# EAGLE design RF212_Radio_Base (EAGLE 4.16)
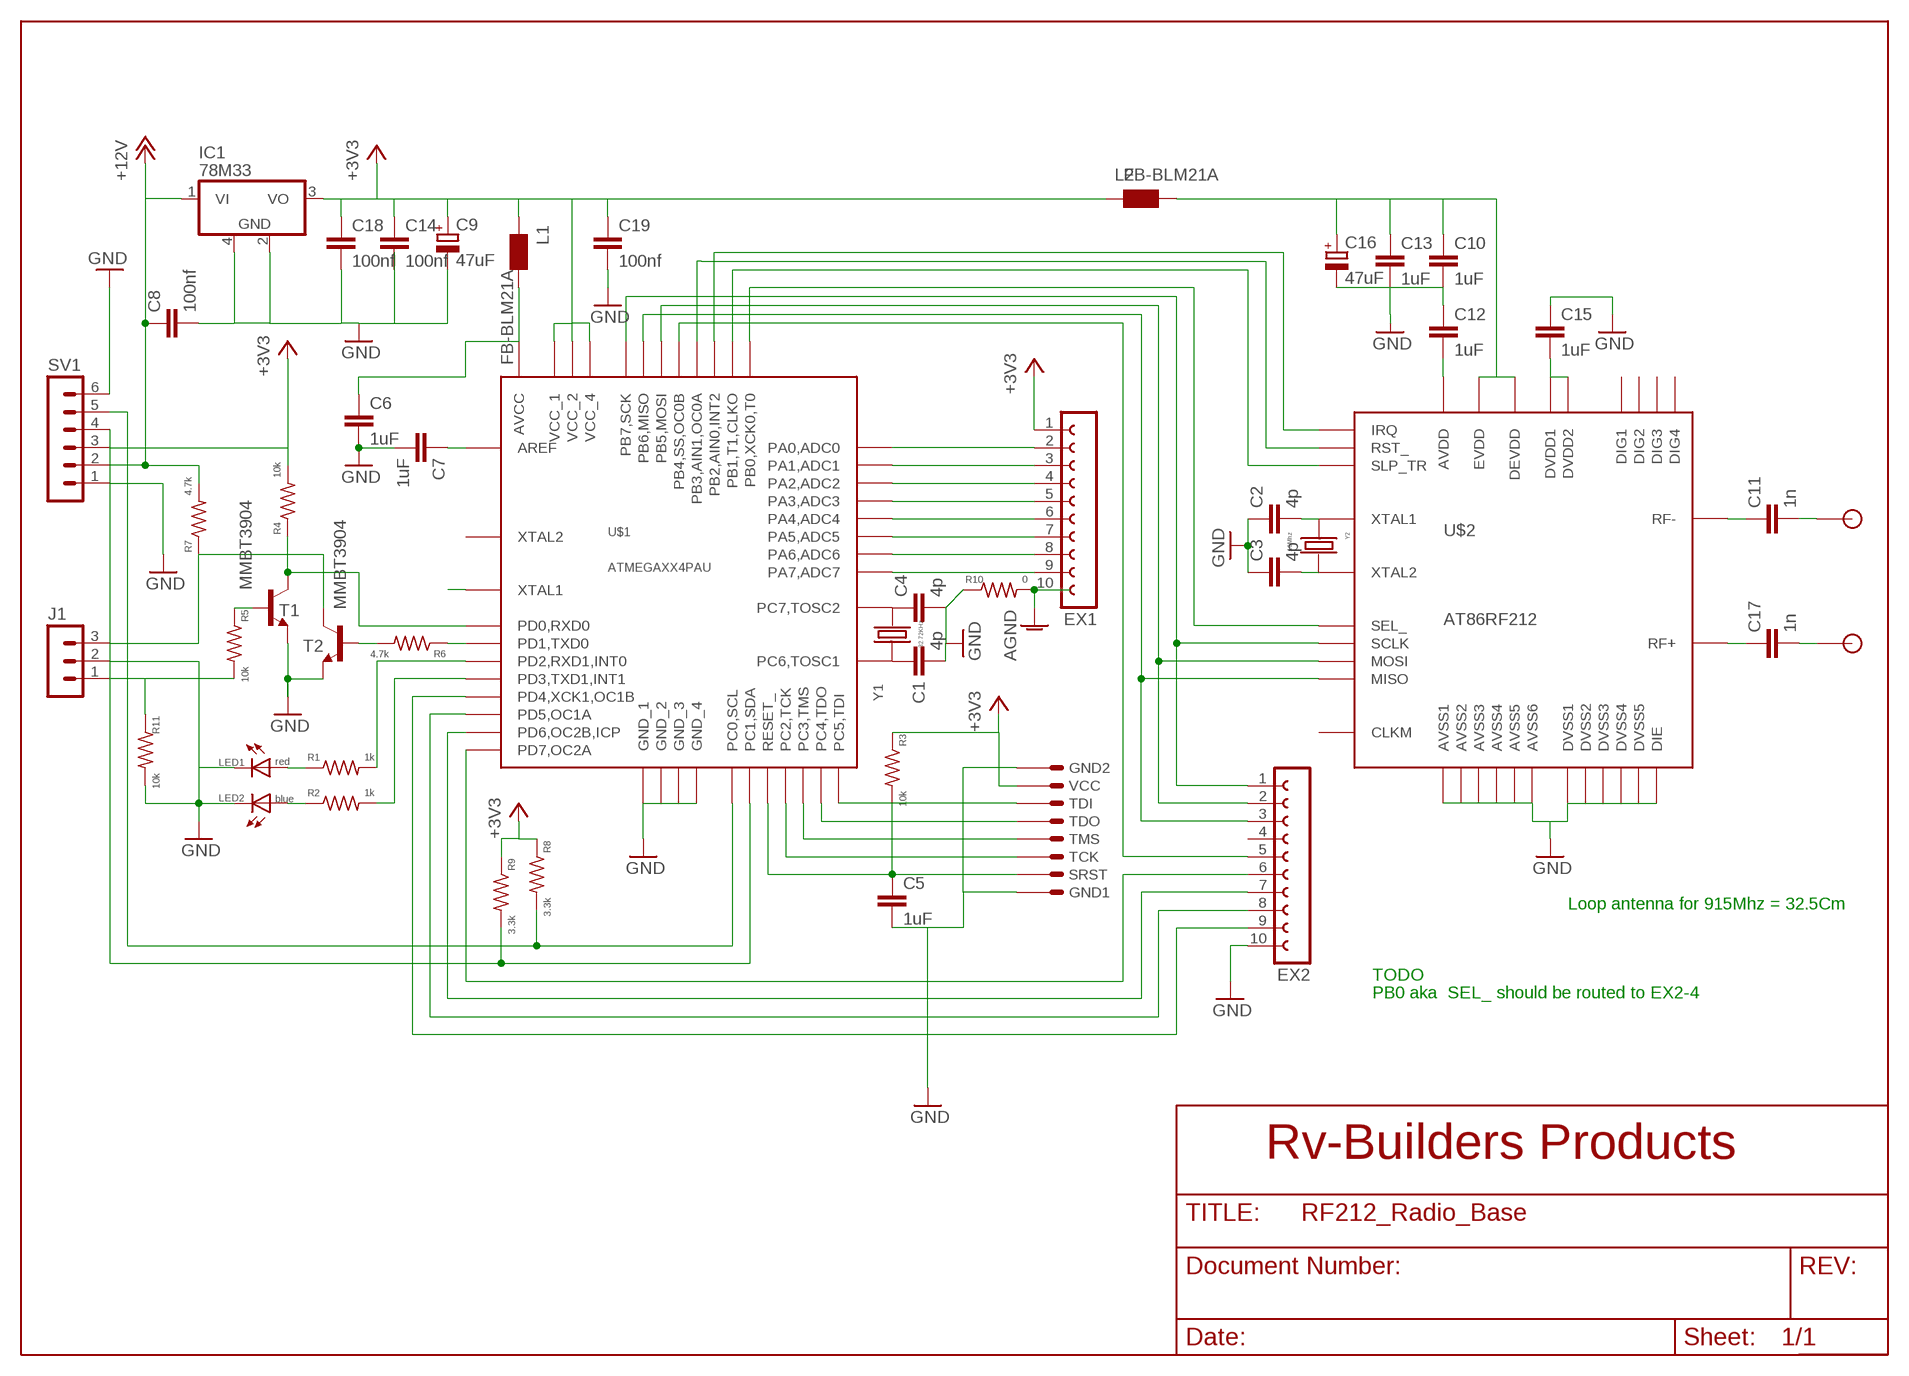
[diagram p0: schematic, sheet 1]

## Parts
C1  4p  C-EUC0805  [C0805]
C2  4p  C-EUC0805  [C0805]
C3  4p  C-EUC0805  [C0805]
C4  4p  C-EUC0805  [C0805]
C5  1uF  C-EUC0805  [C0805]
C6  1uF  C-EUC0805  [C0805]
C7  1uF  C-EUC0805  [C0805]
C8  100nf  C-EUC0805  [C0805]
C9  47uF  CPOL-EUSMCB  [SMC_B]
C10  1uF  C-EUC0805  [C0805]
C11  1n  C-EUC0805  [C0805]
C12  1uF  C-EUC0805  [C0805]
C13  1uF  C-EUC0805  [C0805]
C14  100nf  C-EUC0805  [C0805]
C15  1uF  C-EUC0805  [C0805]
C16  47uF  CPOL-EUSMCB  [SMC_B]
C17  1n  C-EUC0805  [C0805]
C18  100nf  C-EUC0805  [C0805]
C19  100nf  C-EUC0805K  [C0805K]
EX1  FE10-1  [FE10]
EX2  FE10-1  [FE10]
IC1  78M33  LM340MP-05  [SOT223]
J1  MA03-1  [MA03-1]
L1  FB-BLM21A  WE-CBF_0805  [0805]
L2  FB-BLM21A  WE-CBF_0805  [0805]
LED1  red  LEDCHIPLED_0603  [CHIPLED_0603]
LED2  blue  LEDCHIPLED_0603  [CHIPLED_0603]
R1  1k  R-US_R0603  [R0603]
R2  1k  R-US_R0603  [R0603]
R3  10k  R-US_R0805  [R0805]
R4  10k  R-US_R0805  [R0805]
R5  10k  R-US_R0805  [R0805]
R6  4.7k  R-US_R0805  [R0805]
R7  4.7k  R-US_R0805  [R0805]
R8  3.3k  R-US_R0805  [R0805]
R9  3.3k  R-US_R0805  [R0805]
R10  0  R-US_R0603  [R0603]
R11  10k  R-US_R0805  [R0805]
SV1  MA06-1  [MA06-1]
T1  MMBT3904  BC846-NPN-SOT23-BEC  [SOT23-BEC]
T2  MMBT3904  BC846A-NPN-SOT23-BEC  [SOT23-BEC]
U$1  ATMEGAXX4PAU  [TQFP44]
U$2  AT86RF212  [S-PQFP-N32(RHB)]
U$3  JTAG_8P_2X4  [HEADER2X4_50]
U$4  WIRE_POINTMEDIUM  [WIRE_MEDIUM]
U$5  WIRE_POINTMEDIUM  [WIRE_MEDIUM]
Y1  32.72KHz  CRYSTALWATCH  [CRYSTAL32_SMT]
Y2  16Mhz  CRYSTALSMD  [CRYSTAL3.2X2.5]

## Nets
+3V3: C9.+ C14.1 C18.1 C19.1 EX1.1 IC1.3(VO) L1.1 L2.1 R3.1 R4.2 R8.1 R9.1 SV1.3 U$1.5(VCC_1) U$1.17(VCC_2) U$1.38(VCC_4) U$3.VCC
+12V: C8.1 IC1.1(VI) R7.2 SV1.2
ADC0: EX1.2 U$1.37(PA0,ADC0)
ADC1: EX1.3 U$1.36(PA1,ADC1)
ADC2: EX1.4 U$1.35(PA2,ADC2)
ADC3: EX1.5 U$1.34(PA3,ADC3)
ADC4: EX1.6 U$1.33(PA4,ADC4)
ADC5: EX1.7 U$1.32(PA5,ADC5)
ADC6: EX1.8 U$1.31(PA6,ADC6)
ADC7: EX1.9 U$1.30(PA7,ADC7)
AGND: EX1.10 R10.2
AREF: C7.1 U$1.29(AREF)
AVCC: C6.1 L1.2 U$1.27(AVCC)
GND: C1.2 C2.1 C3.1 C4.2 C5.2 C6.2 C7.2 C8.2 C9.- C10.2 C12.1 C13.2 C14.2 C15.1 C16.- C18.2 C19.2 EX2.10 IC1.2(GND1) IC1.4(GND) J1.2 LED1.C LED2.C R10.1 R11.2 SV1.1 SV1.6 T1.E T2.E U$1.6(GND_1) U$1.18(GND_2) U$1.28(GND_3) U$1.39(GND_4) U$2.3(AVSS1) U$2.6(AVSS2) U$2.7(DVSS1) U$2.12(DVSS2) U$2.16(DVSS3) U$2.18(DVSS4) U$2.21(DVSS5) U$2.27(AVSS3) U$2.30(AVSS4) U$2.31(AVSS5) U$2.32(AVSS6) U$2.P$1(DIE) U$3.GND1 U$3.GND2
IRQ: U$1.42(PB2,AIN0,INT2) U$2.24(IRQ)
MISO: EX2.3 U$1.2(PB6,MISO) U$2.20(MISO)
MOSI: EX2.2 U$1.1(PB5,MOSI) U$2.22(MOSI)
N$1: C4.1 U$1.26(PC7,TOSC2) Y1.2
N$2: C1.1 U$1.25(PC6,TOSC1) Y1.1
N$3: C2.2 U$2.26(XTAL1) Y2.IN
N$4: C3.2 U$2.25(XTAL2) Y2.OUT
N$11: C12.2 U$2.29(AVDD)
N$12: EX2.6 U$1.16(PD7,OC2A)
N$14: LED1.A R1.1
N$15: LED2.A R2.1
N$16: R2.2 U$1.12(PD3,TXD1,INT1)
N$17: C15.2 U$2.13(DVDD1) U$2.14(DVDD2)
N$18: C10.1 C13.1 C16.+ L2.2 U$2.15(DEVDD) U$2.28(EVDD)
N$27: C11.1 U$2.5(RF-)
N$28: C17.1 U$2.4(RF+)
N$29: C11.2 U$4.P$1
N$30: C17.2 U$5.P$1
N$39: U$1.8(XTAL1)
N$40: R4.1 T1.C U$1.9(PD0,RXD0)
N$42: R9.2 SV1.4 U$1.20(PC1,SDA)
N$44: R6.1 U$1.10(PD1,TXD0)
N$47: R8.2 SV1.5 U$1.19(PC0,SCL)
N$48: EX2.7 U$1.15(PD6,OC2B,ICP)
N$49: EX2.8 U$1.14(PD5,OC1A)
N$50: EX2.9 U$1.13(PD4,XCK1,OC1B)
N$51: R1.2 U$1.11(PD2,RXD1,INT0)
RF_CHIP_DEVSEL: U$1.40(PB0,XCK0,T0) U$2.23(SEL_)
RS232_RX: J1.1 R5.2 R11.1
RS232_TX: J1.3 R7.1 T2.C
RST_: U$1.43(PB3,AIN1,OC0A) U$2.8(RST_)
RX_BASE: R5.1 T1.B
SCK: EX2.1 U$1.3(PB7,SCK) U$2.19(SCLK)
SLP: U$1.41(PB1,T1,CLKO) U$2.11(SLP_TR)
SPI_SS: EX2.5 U$1.44(PB4,SS,OC0B)
SRST: C5.1 R3.2 U$1.4(RESET_) U$3.SRST
TCK: U$1.21(PC2,TCK) U$3.TCK
TDI: U$1.24(PC5,TDI) U$3.TDI
TDO: U$1.23(PC4,TDO) U$3.TDO
TMS: U$1.22(PC3,TMS) U$3.TMS
TX_BASE: R6.2 T2.B
Unconnected: EX2.4 U$1.7(XTAL2) U$2.1(DIG3) U$2.2(DIG4) U$2.9(DIG1) U$2.10(DIG2) U$2.17(CLKM)

## Notes on the sheet
- Loop antenna for 915Mhz = 32.5Cm
- TODO
- PB0 aka  SEL_ should be routed to EX2-4

## Library data of the parts
C1-C8 C10-C15 C17-C19 = rcl:C-EU: CAPACITOR, European symbol
C9 C16 = rcl:CPOL-EU: POLARIZED CAPACITOR, European symbol
EX1 EX2 = con-lsta:FE10-1: FEMALE HEADER
IC1 = ATMEL:LM340?-*: Positive VOLTAGE REGULATOR Source: http://cache.national.com/ds/LM/LM340.pdf
J1 = con-lstb:MA03-1: PIN HEADER
L1 L2 = wuerth-elektronik:WE-CBF: SMD EMI Suppression Ferrite Beads - excellent anti-EMI properties - low DCR - impedances till 3000 ohms - rated current up to 6 A
LED1 LED2 = led:LED: LED OSRAM: - CHIPLED LG R971, LG N971, LY N971, LG Q971, LY Q971, LO R971, LY R971 LH N974, LH R974 LS Q976, LO Q976, LY Q976 LO Q996 - Hyper CHIPLED LW Q18S LB Q993, LB Q99A, LB R99A - SideLED LS A670, LO A670, LY A670, LG A670, LP A670 LB A673, LV A673, LT A673, LW A673 LH A674 LY A675 LS A676, LA A676, LO A676, LY A676, LW A676 LS A679, LY A679, LG A679 - Hyper Micro SIDELED® LS Y876, LA Y876, LO Y876, LY Y876 LT Y87S - SmartLED LW L88C, LW L88S LB L89C, LB L89S, LG L890 LS L89K, LO L89K, LY L89K LS L896, LA L896, LO L896, LY L896 - TOPLED LS T670, LO T670, LY T670, LG T670, LP T670 LSG T670, LSP T670, LSY T670, LOP T670, LYG T670 LG T671, LOG T671, LSG T671 LB T673, LV T673, LT T673, LW T673 LH T674 LS T676, LA T676, LO T676, LY T676, LB T676, LH T676, LSB T676, LW T676 LB T67C, LV T67C, LT T67C, LS T67K, LO T67K, LY T67K, LW E67C LS E67B, LA E67B, LO E67B, LY E67B, LB E67C, LV E67C, LT E67C LW T67C LS T679, LY T679, LG T679 LS T770, LO T770, LY T770, LG T770, LP T770 LB T773, LV T773, LT T773, LW T773 LH T774 LS E675, LA E675, LY E675, LS T675 LS T776, LA T776, LO T776, LY T776, LB T776 LHGB T686 LT T68C, LB T68C - Hyper Mini TOPLED® LB M676 - Mini TOPLED Santana® LG M470 LS M47K, LO M47K, LY M47K Source: http://www.osram.convergy.de - LUMILED® LXK2-PW12-R00, LXK2-PW12-S00, LXK2-PW14-U00, LXK2-PW14-V00 LXK2-PM12-R00, LXK2-PM12-S00, LXK2-PM14-U00 LXK2-PE12-Q00, LXK2-PE12-R00, LXK2-PE12-S00, LXK2-PE14-T00, LXK2-PE14-U00 LXK2-PB12-K00, LXK2-PB12-L00, LXK2-PB12-M00, LXK2-PB14-N00, LXK2-PB14-P00, LXK2-PB14-Q00 LXK2-PR12-L00, LXK2-PR12-M00, LXK2-PR14-Q00, LXK2-PR14-R00 LXK2-PD12-Q00, LXK2-PD12-R00, LXK2-PD12-S00 LXK2-PH12-R00, LXK2-PH12-S00 LXK2-PL12-P00, LXK2-PL12-Q00, LXK2-PL12-R00 Source: www.luxeon.com
R1-R11 = rcl:R-US_: RESISTOR, American symbol
SV1 = con-lstb:MA06-1: PIN HEADER
T1 T2 = transistor:*-NPN-: NPN Transistror
U$1 = ATMEL:ATMEGAXX4P
U$2 = ATMEL:AT86RF212
U$3 = ATMEL:JTAG_8P_
U$4 U$5 = ATMEL:WIRE_POINT
Y1 Y2 = ATMEL:CRYSTAL

## Board
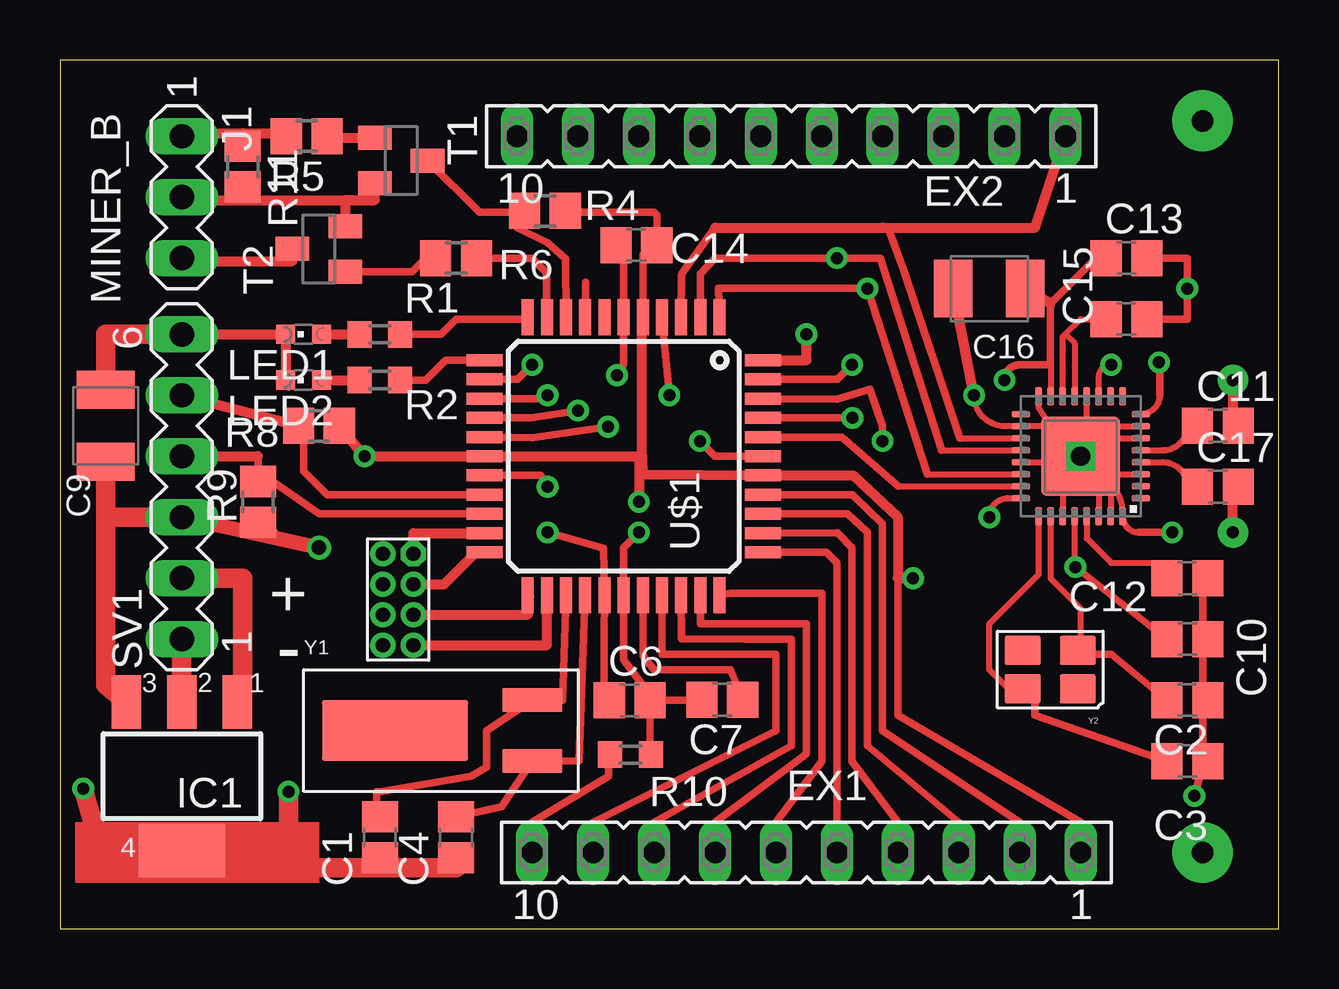
[diagram p1: board, top side]
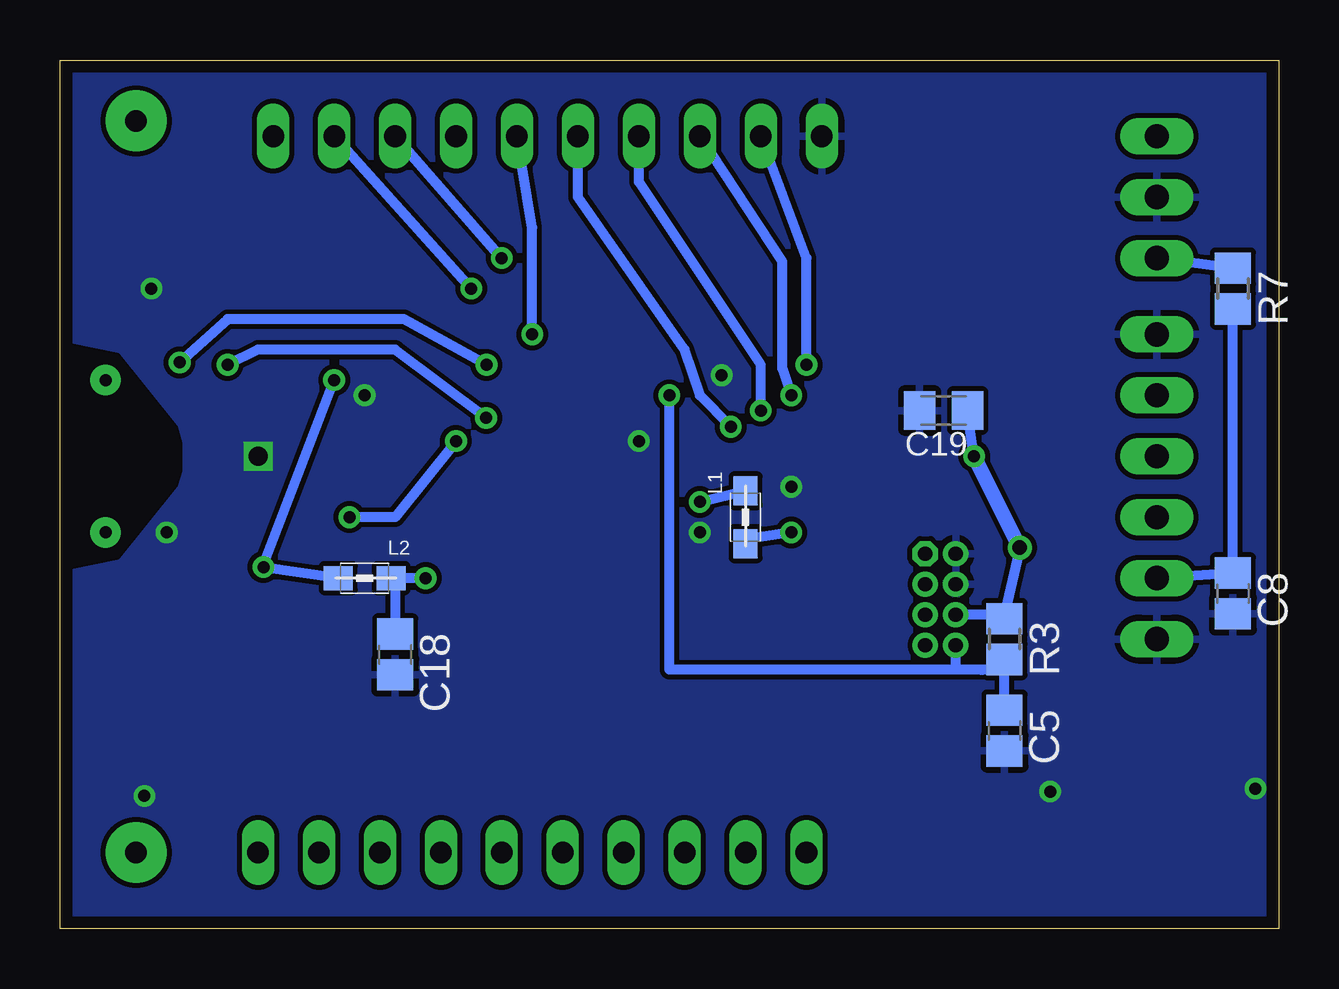
[diagram p2: board, bottom side, seen from below]

Size 50.8 x 36.2 mm. Coordinates in mm from the lower left corner, seen from the top.
Outline: 0,0 50.8,0 50.8,36.2 0,36.2 0,0
Copper layers (1*16): Top 0.0356mm / dielectric 1.5011mm / Bottom 0.0356mm
Design rules "Silvercircuits": minimum track width 7mil, minimum drill 16mil, track to track 8mil, track to pad 8mil, pad to pad 8mil, via to via 8mil, smd to smd 0mil, copper to edge 20mil, drill to drill 8mil, minimum pad ring 9mil, minimum via ring 8mil, stop-mask expansion 4mil, vias tented up to drill 0mil, thermal gap 10mil

### Footprints (pad centres in the part's own frame; a part is rotated, then mirrored left to right if it is on the bottom)
C0805 = smd 1.3 x 1.5: 1 -0.85,0; 2 0.85,0
SMC_B = smd 1.6 x 2.4: + -1.5,0; - 1.5,0
C0805K = smd 1.3 x 1.6: 1 -1,0; 2 1,0
FE10 = drill 0.9 long: 1 -11.43,0; 2 -8.89,0; 3 -6.35,0; 4 -3.81,0; 5 -1.27,0; 6 1.27,0; 7 3.81,0; 8 6.35,0; 9 8.89,0; 10 11.43,0
SOT223 = smd 1.219 x 2.235: 1 -2.311,-3.099; 2 0,-3.099; 3 2.311,-3.099 | smd 3.6 x 2.2: 4 0,3.099
MA03-1 = drill 1.016 long: 1 -2.54,0; 2 0,0; 3 2.54,0
0805 = smd 1.2 x 1: 1 -1.1,0; 2 1.1,0
CHIPLED_0603 = smd 0.8 x 0.8: A 0,-0.75; C 0,0.75
R0603 = smd 1 x 1.1: 1 -0.85,0; 2 0.85,0
R0805 = smd 1.3 x 1.5: 1 -0.85,0; 2 0.85,0
MA06-1 = drill 1.016 long: 1 -6.35,0; 2 -3.81,0; 3 -1.27,0; 4 1.27,0; 5 3.81,0; 6 6.35,0
SOT23-BEC = smd 1 x 1.4: B -0.95,-1.1; C 0,1.1; E 0.95,-1.1
TQFP44 = smd 1.5 x 0.5: 1 -5.8,4; 2 -5.8,3.2; 3 -5.8,2.4; 4 -5.8,1.6; 5 -5.8,0.8; 6 -5.8,0; 7 -5.8,-0.8; 8 -5.8,-1.6; 9 -5.8,-2.4; 10 -5.8,-3.2; 11 -5.8,-4; 23 5.8,-4; 24 5.8,-3.2; 25 5.8,-2.4; 26 5.8,-1.6; 27 5.8,-0.8; 28 5.8,0; 29 5.8,0.8; 30 5.8,1.6; 31 5.8,2.4; 32 5.8,3.2; 33 5.8,4 | smd 0.5 x 1.5: 12 -4,-5.8; 13 -3.2,-5.8; 14 -2.4,-5.8; 15 -1.6,-5.8; 16 -0.8,-5.8; 17 0,-5.8; 18 0.8,-5.8; 19 1.6,-5.8; 20 2.4,-5.8; 21 3.2,-5.8; 22 4,-5.8; 34 4,5.8; 35 3.2,5.8; 36 2.4,5.8; 37 1.6,5.8; 38 0.8,5.8; 39 0,5.8; 40 -0.8,5.8; 41 -1.6,5.8; 42 -2.4,5.8; 43 -3.2,5.8; 44 -4,5.8
S-PQFP-N32(RHB) = smd 0.762 x 0.279: 1 -2.5,1.75; 2 -2.5,1.25; 3 -2.5,0.75; 4 -2.5,0.25; 5 -2.5,-0.25; 6 -2.5,-0.75; 7 -2.5,-1.25; 8 -2.5,-1.75; 17 2.5,-1.75; 18 2.5,-1.25; 19 2.5,-0.75; 20 2.5,-0.25; 21 2.5,0.25; 22 2.5,0.75; 23 2.5,1.25; 24 2.5,1.75 | smd 0.279 x 0.762: 9 -1.75,-2.5; 10 -1.25,-2.5; 11 -0.75,-2.5; 12 -0.25,-2.5; 13 0.25,-2.5; 14 0.75,-2.5; 15 1.25,-2.5; 16 1.75,-2.5; 25 1.75,2.5; 26 1.25,2.5; 27 0.75,2.5; 28 0.25,2.5; 29 -0.25,2.5; 30 -0.75,2.5; 31 -1.25,2.5; 32 -1.75,2.5 | smd 3.3 x 3.3: P$1 0,0
HEADER2X4_50 = drill 0.6 round: GND1 0,0; SRST 3.81,0; TDO 2.54,1.27; TMS 1.27,1.27; VCC 2.54,0 | drill 0.6 pad 1.016 round: GND2 1.27,0; TDI 3.81,1.27 | drill 0.6 octagon: TCK 0,1.27
WIRE_MEDIUM = drill 0.5 pad 1.27 round: P$1 0,0
CRYSTAL32_SMT = smd 2.5 x 1: 1 1.905,1.27; 2 1.905,-1.27 | smd 6.096 x 2.54: GND -3.81,0
CRYSTAL3.2X2.5 = smd 1.5 x 1.2: GND1 -1.147,0.8; GND2 1.15,-0.802; IN -1.147,-0.804; OUT 1.15,0.79

### Placement (x,y rotation side)
C1  13.34,3.81 270 top
C2  46.99,9.53 180 top
C3  46.99,6.98 180 top
C4  16.51,3.81 270 top
C5  11.43,8.26 270 bottom
C6  23.74,9.51 0 top
C7  27.61,9.54 180 top
C8  1.91,13.97 270 bottom
C9  1.91,20.96 90 top
C10  46.99,12.06 0 top
C11  48.26,20.96 0 top
C12  46.99,14.61 180 top
C13  44.45,27.94 0 top
C14  24.03,28.49 180 top
C15  44.45,25.4 180 top
C16  38.73,26.67 180 top
C17  48.26,18.42 0 top
C18  36.83,11.43 270 bottom
C19  13.97,21.59 180 bottom
EX1  31.11,3.17 180 top
EX2  30.48,33.02 180 top
IC1  5.08,6.35 180 top
J1  5.08,30.48 270 top
L1  22.23,17.15 270 bottom
L2  38.1,14.61 180 bottom
LED1  10.16,24.77 90 top
LED2  10.16,22.86 90 top
R1  13.34,24.77 0 top
R2  13.34,22.86 0 top
R3  11.43,12.06 270 bottom
R4  20.22,29.9 0 top
R5  10.29,33.02 180 top
R6  16.51,27.94 180 top
R7  1.91,26.67 270 bottom
R8  10.79,20.96 180 top
R9  8.26,17.78 90 top
R10  23.78,7.25 180 top
R11  7.62,31.75 270 top
SV1  5.08,18.42 90 top
T1  14.22,32 270 top
T2  10.79,28.32 90 top
U$1  23.5,19.69 270 top
U$2  42.55,19.69 180 top
U$3  13.46,15.62 270 top
U$4  48.9,22.86 0 top
U$5  48.9,16.51 0 top
Y1  17.78,8.26 0 top
Y2  41.27,10.79 180 top

### Tracks (layer width: path | path; a pad name or v marks a point on that pad's centre or on a via)
+3V3  (via drill 0.5, 0.6)
  Top 0.305: 34.92,14.61 34.92,8.89 42.55,4.45 EX1.1 | 24.26,25.47 U$1.5 24.3,28.11 24.77,28.58 24.85,28.49 C14.1 24.88,29.73 24.77,29.85 21.59,29.85 21.65,29.9 R4.2 | 24.13,19.69 24.27,19.69
  Top 0.406: 24.26,25.47 24.27,19.69 24.27,18.93 U$1.38 33.05,18.89 34.92,17.15 34.92,14.61 v35.56,14.61 | v24.13,17.78 24.13,19.69 U$1.17 v12.7,19.69 R8.1 | 8.85,16.31 8.89,16.51 R9.1
  Top 0.61: SV1.3 8.85,16.31 v10.79,15.88
  Top 0.813: IC1.3 1.91,10.16 1.91,17.15 | 1.91,17.15 SV1.3 | 1.91,17.15 C9.+
  Bottom 0.406: v24.13,17.78 L1.1 | v12.7,19.69 C19.1 | v35.56,14.61 L2.1 36.83,14.61 C18.1 | 11.43,13.08 R3.1 | 11.43,13.08 U$3.VCC | v10.79,15.88 11.43,13.08
  Bottom 0.61: v10.79,15.88 v12.7,19.69
+12V
  Top 0.61: 7.62,8.89 IC1.1
  Top 0.813: SV1.2 7.62,14.61 7.62,8.89
  Bottom 0.406: SV1.2 C8.1 R7.2
ADC0
  Top 0.305: 33.14,17.98 34.29,16.88 34.29,8.26 40.01,4.45 EX1.2 | 33.14,17.98 33.04,18.08 | 33.14,17.98 | U$1.37 33.04,18.09 33.14,17.98
ADC1
  Top 0.305: U$1.36 32.82,17.29 33.66,16.51 33.66,7.62 37.47,4.45 EX1.3
ADC2
  Top 0.305: U$1.35 32.41,16.49 33.02,15.88 33.02,6.98 34.92,4.45 EX1.4
ADC3
  Top 0.305: EX1.5 32.38,15.24 31.94,15.69 U$1.34
ADC4
  Top 0.305: EX1.6 29.84,4.45 31.75,6.98 31.75,13.97 27.94,13.97 27.53,13.9 U$1.33
ADC5
  Top 0.305: EX1.7 27.3,4.45 31.09,7.26 | 31.09,7.26 | 31.09,7.26 31.09,7.31 31.12,7.33 31.11,7.34 31.11,12.7 26.7,12.7 U$1.32
ADC6
  Top 0.305: EX1.8 24.77,4.45 30.48,7.62 30.48,12.06 28.57,12.06 25.9,12.07 U$1.31
ADC7
  Top 0.305: 28.57,11.43 29.84,11.43 29.84,8.26 22.23,4.45 EX1.9 | 28.57,11.43 28.16,11.43 | 28.57,11.43 | 28.57,11.43 25.4,11.43 | 25.4,11.43 25.11,11.43 | 25.4,11.43 25.09,11.43 U$1.30
AGND
  Top 0.305: R10.2 22.86,7.18 22.86,6.35 19.68,4.45 EX1.10
AREF
  Top 0.305: U$1.29 24.3,11.38 24.77,10.79 27.94,10.79 C7.1
AVCC  (via drill 0.5)
  Top 0.305: v20.32,16.51 22.65,15.85 U$1.27 22.69,12.05 22.69,9.7 22.87,9.51 C6.1
  Bottom 0.305: 22.31,16.2 L1.2
  Bottom 0.406: v20.32,16.51 22.31,16.2
GND  (via drill 0.5, 0.8)
  Top 0.229: 40.8,22.07 U$2.16 | 44.3,17.3 U$2.32
  Top 0.254: U$2.3 43.3,18.94 U$2.30 | 43.8,20.94 U$2.7 | 43.3,20.44 U$2.6 | 42.8,19.94 U$2.12 | U$2.21 41.66,19.44 | 41.26,20.94 U$2.18 39.39,20.94 arc-90 v38.1,22.23 | 43.8,18.44 U$2.31 | 41.8,19.57 U$2.27 | 42.55,19.05 arc-90 44.3,17.3 | U$2.32 arc90 44.97,16.51 | 40.8,22.07 40.8,21.7 41.27,20.96
  Top 0.305: 43.18,20.96 arc90 43.2,20.94 41.91,20.32 | U$2.P$1 43.18,19.05 | 41.91,20.32 43.8,20.94 | U$2.P$1 41.91,20.32 | 41.91,20.32 43.3,20.44 | U$2.P$1 42.8,19.94 | 41.91,20.32 42.55,20.32 U$2.P$1 | 41.91,19.69 U$2.P$1 | 41.91,20.32 41.59,20.64 | 41.59,20.64 41.27,20.96 41.26,20.94 | 41.66,19.44 41.91,19.69 | 43.18,19.05 43.3,18.94 | 43.18,19.05 43.8,18.44 | 41.91,19.69 41.8,19.57 | C15.1 46.99,25.4 v46.99,26.67 46.99,27.94 C13.2 | v26.67,20.32 27.3,19.69 U$1.39 | v24.13,16.51 23.5,15.88 U$1.28 23.5,11.21 24.77,9.53 24.75,9.51 C6.2 | v23.22,23.06 23.5,23.5 U$1.6 23.5,27.94 C14.2 | 41.59,20.64 arc-90 41.91,20.96 | U$2.P$1 42.55,19.05 | U$1.18 20.02,18.88 v20.32,18.42 | C7.2 26.67,9.53 C6.2 | LED1.C 9.42,24.87 | 44.97,16.51 v46.35,16.51 | 24.64,7.12 24.77,6.98 | R10.1 24.64,7.12 | C6.2 24.59,7.16 24.64,7.12 | 47.62,9.53 47.62,7.2 C3.1 47.62,6.77 v47.28,5.53 | 47.62,9.53 C2.1 | 47.62,9.53 47.62,12.06 | 47.62,12.06 C10.2 | C12.1 47.62,14.39 47.62,12.06
  Top 0.406: v38.1,22.23 C16.- | SV1.6 9.4,24.77 | J1.2 5.08,30.35 7.62,30.35 | T1.E 13.12,30.35 12.19,30.35 | 7.62,30.35 12.19,30.35 | T2.E 11.89,30.35 12.19,30.35 | 9.4,24.77 LED1.C | LED2.C 9.4,22.86 9.4,24.77 | 7.62,30.35 R11.2
  Top 0.813: IC1.2 SV1.1 | 6.35,2.54 5.71,2.54 | 6.35,2.54 9.53,2.54 | 9.53,2.54 13.34,2.54 | 13.34,2.54 C1.2 | C4.2 16.51,2.54 13.34,2.54 | 6.35,2.54 IC1.4 | 6.35,2.54 6.35,3.17 | C9.- 1.91,24.77 SV1.6 | 9.53,2.54 v9.53,5.71 | 1.91,2.54 v0.97,5.84
  Bottom 0.305: C8.2 1.91,12.7
  other vias: 42.55,19.69
  pour Bottom: 51.44,14.61 48.26,15.24 45.72,18.42 45.54,19.02 45.54,20.29 45.72,20.96 48.26,24.13 51.44,24.77 51.44,40 -2.54,40 -2.54,-1.91 51.44,-1.91
IRQ  (via drill 0.5)
  Top 0.229: 40.08,17.94 U$2.24
  Top 0.254: 40.08,17.94 39.53,17.94 arc90 v38.73,17.15
  Top 0.305: U$1.42 32.4,22.07 33.76,22.48 34.29,20.96 v34.29,20.32
  Bottom 0.406: v34.29,20.32 36.83,17.15 v38.73,17.15
MISO  (via drill 0.5)
  Top 0.254: 36.73,19.99 36.72,19.99 36.71,19.98 36.75,19.94 U$2.20
  Top 0.305: 36.74,19.94 36.73,19.99 34.2,27.94 v32.38,27.94 27.3,27.94 26.7,27.3 U$1.2
  Bottom 0.406: v32.38,27.94 EX2.3
MOSI  (via drill 0.5)
  Top 0.254: 36.14,19 36.13,19 36.12,19 36.19,18.94 U$2.22
  Top 0.305: 33.65,26.69 36.14,19 36.17,18.93 | U$1.1 27.45,26.69 33.65,26.69 | 33.65,26.69 v33.66,26.67
  Bottom 0.406: v33.66,26.67 EX2.2
N$1
  Top 0.305: U$1.26 21.63,6.99 Y1.2 18.41,5.08 C4.1
N$2
  Top 0.305: U$1.25 20.95,9.53 Y1.1 17.78,8.26 17.78,6.73 17.14,6.35 13.34,5.71 13.21,5.71 13.21,4.66 C1.1
N$3
  Top 0.254: U$2.26 41.3,14.58 42.55,13.33 42.55,11.43 42.55,11.47 Y2.IN
  Top 0.305: C2.2 43.81,11.43 42.55,11.43 Y2.IN
N$4
  Top 0.254: U$2.25 40.8,14.76 38.73,12.7 38.73,10.79 39.52,10
  Top 0.305: C3.2 40.64,8.89 40.64,9.53 40.12,10.04 | 40.12,10.04 40.01,10.16 | 40.12,10.04 Y2.OUT 39.52,10
N$7  (via drill 0.9 pad 2.54)
  other vias: 47.62,33.66
N$8  (via drill 0.9 pad 2.54)
  other vias: 47.62,3.17
N$11
  Top 0.254: U$2.29 42.8,16.26 43.81,15.24 45.72,15.24 46.35,14.61 C12.2
N$12  (via drill 0.5)
  Top 0.305: U$1.16 19.7,20.46 v22.84,20.91
  Bottom 0.406: v22.84,20.91 24.13,22.23 24.77,24.13 29.21,30.48 EX2.6
N$14
  Top 0.406: LED1.A R1.1
N$15
  Top 0.406: 12.7,22.86 R2.1 LED2.A
N$16
  Top 0.305: R2.2 14.61,22.86 | U$1.12 16.07,23.69 15.24,22.86 R2.2 | R2.2 13.97,22.86
N$17
  Top 0.254: U$2.13 42.29,23.43 42.29,24.38 41.91,24.77 | U$2.14 41.8,23.43 41.8,24.65 41.91,24.77 | 41.91,24.77 42.55,25.4 43.81,25.4
  Top 0.305: 43.81,25.4 C15.2
N$18  (via drill 0.5)
  Top 0.254: 42.34,15.07 42.4,15.01 | v42.32,15.07 42.34,15.07 | U$2.28 42.3,15.12 42.34,15.07 | U$2.15 41.3,23.5 41.27,23.5
  Top 0.305: C13.1 43.18,27.94 41.27,26.04 41.27,23.5 40.01,23.5 arc90 v39.37,22.86 | 42.32,15.02 v42.32,15.07 42.35,15.06 C10.1
  Top 0.406: 41.27,26.04 C16.+
  Bottom 0.305: v42.32,15.07
  Bottom 0.406: L2.2 42.37,15.05 v42.32,15.07 42.38,15.03 v39.37,22.86
N$27
  Top 0.254: U$2.5 45.97,19.94 arc90 46.99,20.96
  Top 0.305: 46.99,20.96 C11.1
N$28
  Top 0.254: U$2.4 45.97,19.44 arc-90 46.99,18.42
  Top 0.305: 46.99,18.42 C17.1
N$29
  Top 0.406: C11.2 48.9,20.96 U$4.P$1
N$30
  Top 0.406: C17.2 48.9,18.42 U$5.P$1
N$39
  Top 0.305: U$1.8 21.9,26.93
N$40
  Top 0.254: 15.88,32.13 15.88,31.75
  Top 0.305: U$1.9 21.08,27.92 20.32,28.58 19.05,29.21 19.05,29.85 | 19.05,29.85 R4.1 | 19.05,29.85 17.48,29.85 T1.C 15.24,31.92 15.24,31.75 15.49,31.75 15.88,32.13
N$42
  Top 0.305: U$1.20 10.8,17.28 8.26,19.05 | 8.26,19.05 R9.2 | 8.26,19.69 8.26,19.05
  Top 0.406: SV1.4 8.26,19.69
N$44
  Top 0.305: U$1.10 20.29,26.97 20.29,27.34 19.68,27.94 R6.1
N$47
  Top 0.305: SV1.5 5.71,22.23 | U$1.19 11.12,18.09 10.16,19.05 10.16,20.96 R8.2
  Top 0.406: SV1.5 R8.2
N$48  (via drill 0.5)
  Top 0.305: U$1.15 19.66,21.3 v21.59,21.59
  Bottom 0.406: v21.59,21.59 21.59,23.5 26.67,31.12 EX2.7
N$49  (via drill 0.5)
  Top 0.305: U$1.14 20.18,22.09 v20.32,22.23
  Bottom 0.406: v20.32,22.23 20.69,23.35 20.69,27.79 EX2.8
N$50  (via drill 0.5)
  Top 0.305: U$1.13 19.07,22.89 v19.68,23.5
  Bottom 0.406: v19.68,23.5 19.68,27.94 EX2.9
N$51
  Top 0.305: R1.2 15.88,24.77 16.51,25.4 19.41,25.4 U$1.11
RF_CHIP_DEVSEL
  Top 0.254: 34.94,18.44 U$2.23
  Top 0.305: 34.94,18.44 32.59,20.49 31.95,20.48 U$1.40
RS232_RX
  Top 0.406: 8.8,33.15 8.89,33.15 | 8.8,33.15 R5.2 | J1.1 5.08,33.15 7.62,33.15 | 7.62,33.15 8.8,33.15 | 7.62,33.15 R11.1
RS232_TX
  Top 0.406: J1.3 5.08,27.81 9.7,27.81 T2.C
  Bottom 0.406: R7.1 J1.3
RST_  (via drill 0.5)
  Top 0.254: 45.84,22.23 arc-90 U$2.8
  Top 0.305: v45.81,23.59 arc90 45.82,23.58 45.84,23.58 45.84,22.23 | U$1.43 32.41,22.89 v33.02,23.5
  Bottom 0.406: v45.81,23.59 43.81,25.4 36.46,25.4 v33.02,23.5
RX_BASE
  Top 0.406: R5.1 11.43,33.02 11.43,32.95 T1.B
SCK
  Top 0.254: 37.5,20.43 | 37.51,20.43 37.5,20.43 | U$2.19 37.5,20.44 37.5,20.43
  Top 0.305: 37.51,20.43 35.15,27.47 34.52,29.17 34.29,29.18 34.29,29.21 | U$1.3 25.9,27.26 27.3,29.21
  Top 0.406: 27.3,29.21 34.29,29.21 40.64,29.21 EX2.1
SLP  (via drill 0.5)
  Top 0.229: 43.29,22.18 U$2.11 | v43.81,23.5 arc90 43.29,22.97
  Top 0.254: 43.29,22.97 43.29,22.18
  Top 0.305: U$1.41 v33.04,21.28
  Bottom 0.406: v33.04,21.28 36.83,24.13 42.55,24.13 v43.81,23.5
SPI_SS  (via drill 0.5)
  Top 0.406: U$1.44 31.11,23.69 31.11,24.13 v31.11,24.77
  Bottom 0.406: EX2.5 31.11,29.21 v31.11,24.77
SRST  (via drill 0.5)
  Top 0.305: U$1.4 25.1,25.36 v25.4,22.23
  Bottom 0.406: v25.4,22.23 25.4,10.79 13.46,10.79 | 12.45,10.79 12.32,10.79 | 12.45,10.79 13.46,10.79 | 13.46,10.79 U$3.SRST | 11.43,10.79 R3.2 | 12.45,10.79 11.68,10.79 11.43,10.79 | C5.1 11.43,10.79
TCK
  Top 0.406: U$1.21 14.73,16.48 U$3.TCK
TDI
  Top 0.406: 20.32,13.86 U$1.24 20.3,11.81 U$3.TDI
TDO
  Top 0.406: 19.56,13.84 19.54,13.84 U$1.23 19.5,13.08 U$3.TDO
TMS
  Top 0.406: U$1.22 17.34,15.69 16,14.35 U$3.TMS
TX_BASE
  Top 0.305: R6.2 15.24,27.94 14.67,27.37 T2.B
(copper drawn outside any net)
  shapes: Top area x1

### Text on the board
tPlace: MINER_B | + | -
Drill_legend: Drill legend | Date: 6/04/2010 04:27:41p | 1 different diameters with default symbols! (9 drills) | 1.0160 mm / 40.000 mil | 0.9000 mm / 35.433 mil | 0.6000 mm / 23.622 mil | 0.5000 mm / 19.685 mil